# Altium project ThunderGuppy_3.0.PrjPcb (part 2 of 2)

## Sheet GPS.SchDoc
size A
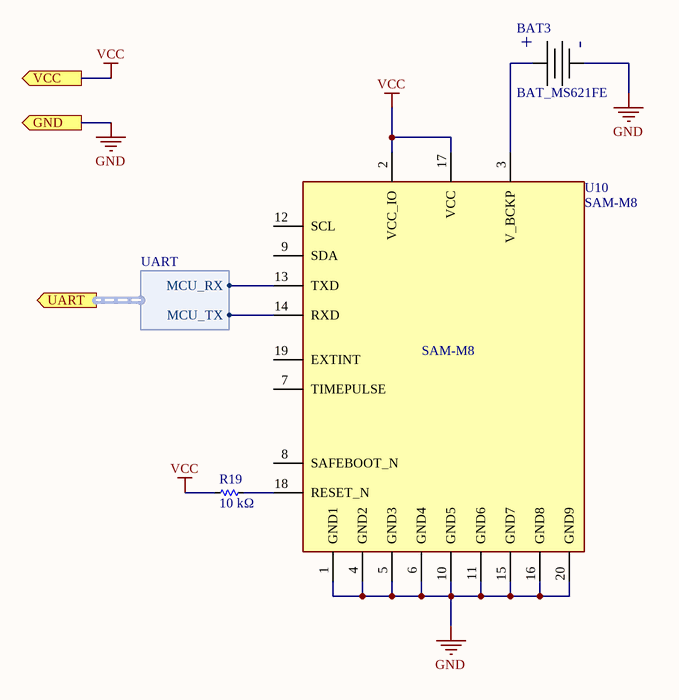
[diagram p6: GPS.SchDoc]

### Parts
BAT3  BAT_MS621FE  [BATT_COINCELL_RECHARGEABLE]
R19  Resistance: 10 kΩ  [R0603]  (hidden comment: 311-10.0KHRCT-ND)
U10  SAM-M8  [SAM-M8]

### Ports
GND (out), UART (out, harness UART), VCC (out)

### Harnesses
UART: MCU_RX, MCU_TX

### Nets
GND: BAT3.- U10.1(GND1) U10.4(GND2) U10.5(GND3) U10.6(GND4) U10.10(GND5) U10.11(GND6) U10.15(GND7) U10.16(GND8) U10.20(GND9) ; port GND
VCC: R19.1 U10.2(VCC_IO) U10.17(VCC) ; port VCC  [project net 3V3]
NetBAT3_+: BAT3.+ U10.3(V_BCKP)
NetR19_2: R19.2 U10.18(RESET_N)
NetU10_13: U10.13(TXD) ; port UART.MCU_RX
NetU10_14: U10.14(RXD) ; port UART.MCU_TX

Not connected (* = marked no-connect by the designer): U10 7(TIMEPULSE) 8(SAFEBOOT_N) 9(SDA) 12(SCL) 19(EXTINT)

### Library data of the parts
BAT3 = CMP-060-0000-1: MS621FE RECHARGEABLE COIN CELL BACKUP; Manufacturer: Seiko Instruments; Manufacturer Part Number: MS621FE-FL11E; Battery Chemistry: Lithium; Battery Cell Size: Coin, 6.8mm; Capacity: 5.5mAh; Discharge Rate: 15µA; Shipping Info: Due to restrictions, only ground shipment is allowed.; RoHS: RoHS Compliant; Stock 1: 41059; Pricing 1: 1=2.04, 10=1.838, 50=1.6338, 100=1.4296, 250=1.30704, 500=1.22534, 1000=1.09051, 2500=1.0112, 5000=0.99138 (USD); Part Status: Active; Size / Dimension: 0.27" Dia x 0.08" H (6.8mm x 2.1mm); Termination Style: SMD (SMT) Tab; Standard Charge Current: 15µA; Standard Charge Time: -; Weight: 0.23g; ComponentLink1URL: http://www.sii.co.jp/en/me/files/2017/04/MicroBatteryCatalogue-E_2017_web.pdf; ComponentLink1Description: http://www.sii.co.jp/en/me/files/2017/04/MicroBatteryCatalogue-E_2017_web.pdf; Design Item ID: BAT_MS621FE; Source: miscellaneous.SchLib
R19 = CMP-126-0273-1: RES SMD 10K OHM 1% 1/10W 0603; Manufacturer Part Number: RC0603FR-0710KL; Manufacturer: Yageo; Resistance (Sortable): 10000; Power (Watts): 0.1W, 1/10W; Temperature Coefficient: ±100ppm/°C; Datasheets: http://www.yageo.com/documents/recent/PYu-RC_Group_51_RoHS_L_9.pdf; Image: //media.digikey.com/Renders/Yageo%20Renders/0603-(1608-Metric).jpg; Tolerance: ±1%; Operating Temperature: -55°C ~ 155°C
U10 = SAM-M8: ublox SAM GNSS antenna module; Manufacturer: u-blox; Part Description: u-blox SAM GNSS antenna module; Value: SAM-M8

## Sheet Ematches.SchDoc
size A
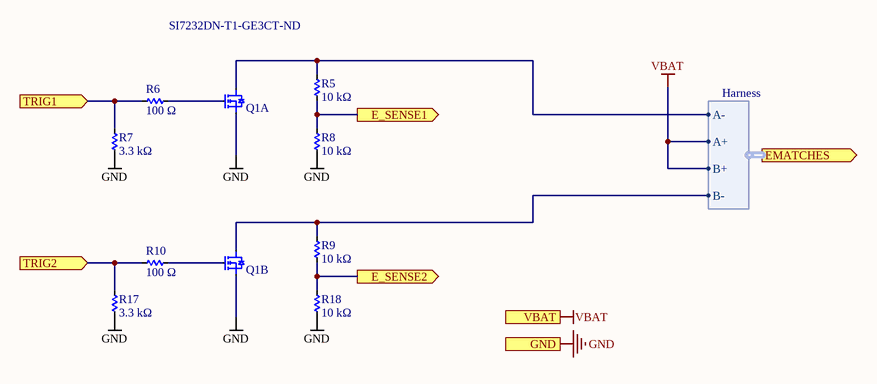
[diagram p7: Ematches.SchDoc]

### Parts
Q1  Supplier Part Number 1: SI7232DN-T1-GE3CT-ND  [POWERPAK_1212-8_DUAL]  (hidden comment: NFET_SI7232DN)  (parts A,B of 2)
R5  Resistance: 10 kΩ  [R0603]  (hidden comment: __template_resistor)
R6  Resistance: 100 Ω  [R0603]  (hidden comment: __template_resistor)
R7  Resistance: 3.3 kΩ  [R0603]  (hidden comment: __template_resistor)
R8  Resistance: 10 kΩ  [R0603]  (hidden comment: __template_resistor)
R9  Resistance: 10 kΩ  [R0603]  (hidden comment: __template_resistor)
R10  Resistance: 100 Ω  [R0603]  (hidden comment: __template_resistor)
R17  Resistance: 3.3 kΩ  [R0603]  (hidden comment: __template_resistor)
R18  Resistance: 10 kΩ  [R0603]  (hidden comment: __template_resistor)

### Ports
E_SENSE1 (out), E_SENSE2 (out), EMATCHES (out, harness Harness), GND (in), TRIG1 (in), TRIG2 (in), VBAT (in)

### Harnesses
Harness: A-, A+, B+, B-

### Nets
GND: Q1.1 Q1.3 R7.1 R8.2 R17.1 R18.2 ; port GND
VBAT: port VBAT, port EMATCHES.A+, port EMATCHES.B+
NetQ1_2: Q1.2 R6.2
NetQ1_4: Q1.4 R10.2
NetQ1_5: Q1.5 R9.1 ; port EMATCHES.B-
NetQ1_7: Q1.7 R5.1 ; port EMATCHES.A-
NetR5_2: R5.2 R8.1 ; port E_SENSE1
NetR6_1: R6.1 R7.2 ; port TRIG1
NetR9_2: R9.2 R18.1 ; port E_SENSE2
NetR10_1: R10.1 R17.2 ; port TRIG2

### Library data of the parts
Q1 = NFET_SI7232DN: MOSFET 2N-CH 20V 25A PPAK 1212-8; Manufacturer: Vishay Siliconix; Manufacturer Part Number: SI7232DN-T1-GE3; FET Type: 2 N-Channel (Dual); FET Feature: Logic Level Gate; Rds On (Max) @ Id, Vgs: 16.4 mOhm @ 10A, 4.5V; Vgs(th) (Max) @ Id: 1V @ 250µA; Gate Charge (Qg) @ Vgs: 32nC @ 8V; Input Capacitance (Ciss) @ Vds: 1220pF @ 10V; Power - Max: 23W; Supplier 1: Digi-Key; RoHS: RoHS Compliant; Category: Discrete Semiconductor Products; Stock 1: 12645; Pricing 1: 1=0.89, 10=0.782, 25=0.7344, 100=0.5994, 250=0.55672, 500=0.4738, 1000=0.37904 (USD); Packaging: Cut Tape (CT); Drain to Source Voltage (Vdss): 20V; Current - Continuous Drain (Id) @ 25°C: 25A; Operating Temperature: -55°C ~ 150°C (TJ); Mounting Type: Surface Mount; Package / Case: PowerPAK® 1212-8 Dual; Supplier Device Package: PowerPAK® 1212-8 Dual; ComponentLink1URL: http://www.vishay.com/docs/68986/si7232dn.pdf; ComponentLink1Description: http://www.vishay.com/docs/68986/si7232dn.pdf
R5 R8 R9 R18 = 311-10.0KHRCT-ND: RES SMD 10K OHM 1% 1/10W 0603; Manufacturer Part Number: RC0603FR-0710KL; Manufacturer: Yageo; Power (Watts): 0.1W, 1/10W; Resistance (Sortable): 10000; Temperature Coefficient: ±100ppm/°C; Tolerance: ±1%; Supplier Part Number 1: 311-10.0KHRCT-ND; Supplier 1: Digikey; Datasheets: http://www.yageo.com/documents/recent/PYu-RC_Group_51_RoHS_L_9.pdf; Image: //media.digikey.com/Renders/Yageo%20Renders/0603-(1608-Metric).jpg; Operating Temperature: -55°C ~ 155°C
R6 R10 = 311-100HRCT-ND: RES SMD 100 OHM 1% 1/10W 0603; Manufacturer Part Number: RC0603FR-07100RL; Manufacturer: Yageo; Power (Watts): 0.1W, 1/10W; Resistance (Sortable): 100; Temperature Coefficient: ±100ppm/°C; Tolerance: ±1%; Supplier Part Number 1: 311-100HRCT-ND; Supplier 1: Digikey; Datasheets: http://www.yageo.com/documents/recent/PYu-RC_Group_51_RoHS_L_9.pdf; Image: //media.digikey.com/Renders/Yageo%20Renders/0603-(1608-Metric).jpg; Operating Temperature: -55°C ~ 155°C
R7 R17 = 311-3.30KHRCT-ND: RES SMD 3.3K OHM 1% 1/10W 0603; Manufacturer Part Number: RC0603FR-073K3L; Manufacturer: Yageo; Power (Watts): 0.1W, 1/10W; Resistance (Sortable): 3300; Temperature Coefficient: ±100ppm/°C; Tolerance: ±1%; Supplier Part Number 1: 311-3.30KHRCT-ND; Supplier 1: Digikey; Datasheets: http://www.yageo.com/documents/recent/PYu-RC_Group_51_RoHS_L_9.pdf; Image: //media.digikey.com/Renders/Yageo%20Renders/0603-(1608-Metric).jpg; Operating Temperature: -55°C ~ 155°C

## Sheet RS485.SchDoc
size A
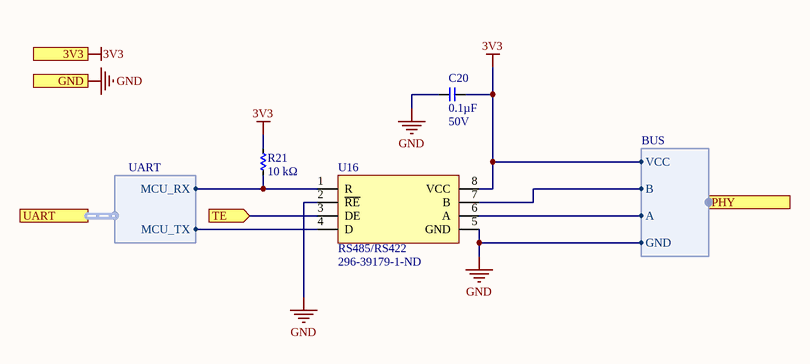
[diagram p8: RS485.SchDoc]

### Parts
C20  Capacitance (shorthand): 0.1µF  Rated Voltage: 50V  [C0603]  (hidden comment: __template_cap)
R21  Resistance: 10 kΩ  [R0603]  (hidden comment: __template_resistor)
U16  RS485/RS422  Supplier Part Number 1: 296-39179-1-ND  [8SOIC150]

### Ports
3V3 (in), GND (in), PHY (out, harness BUS), TE (in), UART (harness UART)

### Harnesses
UART: MCU_RX, MCU_TX
BUS: A, B, GND, VCC

### Nets
3V3: C20.2 R21.1 U16.8(VCC) ; port 3V3, port PHY.VCC
GND: C20.1 U16.2(~{RE}) U16.5(GND) ; port GND, port PHY.GND
RS485_TE: U16.3(DE) ; port TE
SELF_BUS_H: U16.6(A) ; port PHY.A
SELF_BUS_L: U16.7(B) ; port PHY.B
NetCANA1_1: R21.2 U16.1(R) ; port UART.MCU_RX
NetCANA1_4: U16.4(D) ; port UART.MCU_TX

### Library data of the parts
C20 = 490-1519-1-ND: CAP CER 0603 0.1µF X7R 50V 10%; Manufacturer: Murata Electronics North America; Capacitance - pF (Machine readable): #NAME?; type: capacitor; Dielectric: X7R; Supplier 1: Digikey; Supplier Part Number 1: 490-1519-1-ND
R21 = 311-10.0KHRCT-ND: as R5 on sheet Ematches; Tolerance: ±1%; Supplier Part Number 1: 311-10.0KHRCT-ND; Supplier 1: Digikey; Datasheets: http://www.yageo.com/documents/recent/PYu-RC_Group_51_RoHS_L_9.pdf; Image: //media.digikey.com/Renders/Yageo%20Renders/0603-(1608-Metric).jpg; Operating Temperature: -55°C ~ 155°C
U16 = SN65HVD7x: Manufacturer: Texas Instruments; Manufacturer Part Number: SN65HVD72DGKR; Min Supply Voltage: 3V; Max Supply Voltage: 3.6V; Number of Receivers: 1; Output Current: 8mA; Data Rate: 0.25Mbps; Logic Function: Transceiver; Simplex/Duplex: Half Duplex; Supply Voltage: 3.3V; Nominal Supply Current: 950uA; Output Voltage: 2V; Propagation Delay: 0.7us; Interface: RS-485; Case/Package: VSSOP; Number of Pins: 8; Min Operating Temperature: -40°C; Max Operating Temperature: 125°C; Packaging: Tape and Reel; Package Quantity: 2500; Number of Drivers: 1; Number of Transmitters: 1; Number of Transceivers: 1; Radiation Hardening: No; Lead Free: Lead Free; REACH SVHC: No SVHC; ComponentLink1URL: https://datasheet.ciiva.com/28650/1787953-28650706.pdf; ComponentLink1Description: https://datasheet.ciiva.com/28650/1787953-28650706.pdf; ComponentLink2URL: https://datasheet.ciiva.com/24096/sn65hvd72-446416-24096821.pdf; ComponentLink2Description: https://datasheet.ciiva.com/24096/sn65hvd72-446416-24096821.pdf; ComponentLink3URL: https://datasheet.ciiva.com/6636/sn65hvd72-6636345.pdf; ComponentLink3Description: https://datasheet.ciiva.com/6636/sn65hvd72-6636345.pdf; ComponentLink4URL: https://datasheet.ciiva.com/26946/getdatasheetpartid-716725-26946073.pdf; ComponentLink4Description: https://datasheet.ciiva.com/26946/getdatasheetpartid-716725-26946073.pdf; ComponentLink5URL: https://datasheet.ciiva.com/6636/sn65hvd72-6636346.pdf; ComponentLink5Description: https://datasheet.ciiva.com/6636/sn65hvd72-6636346.pdf; ComponentLink6URL: https://datasheet.ciiva.com/6636/sn65hvd72-6636347.pdf; ComponentLink6Description: https://datasheet.ciiva.com/6636/sn65hvd72-6636347.pdf; ComponentLink7URL: https://datasheet.ciiva.com/14195/sn65hvd75-14195211.pdf; ComponentLink7Description: https://datasheet.ciiva.com/14195/sn65hvd75-14195211.pdf; ComponentLink8URL: https://datasheet.ciiva.com/41461/001187608-da-01-en-ic-txrx-rs485-sn65hvd72dgkr-vssop-8-tid-41461063.pdf; ComponentLink8Description: https://datasheet.ciiva.com/41461/001187608-da-01-en-ic-txrx-rs485-sn65hvd72dgkr-vssop-8-tid-41461063.pdf; Supplier 1: Digi-Key

## Sheet CAN.SchDoc
size A
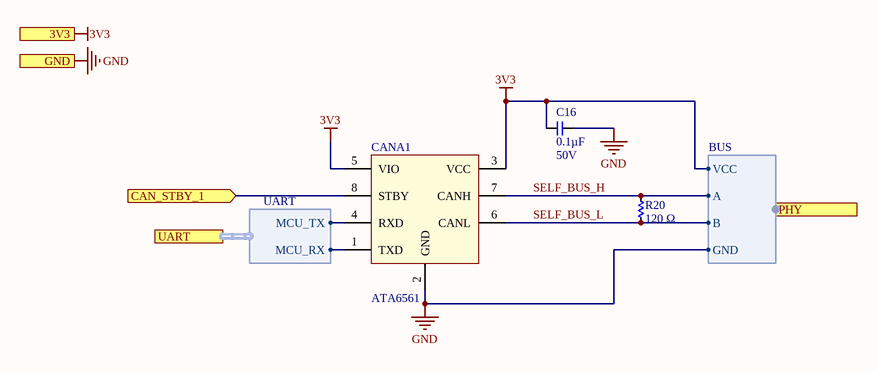
[diagram p9: CAN.SchDoc]

### Parts
C16  Capacitance (shorthand): 0.1µF  Rated Voltage: 50V  [C0603]  (hidden comment: 490-1519-1-ND)
CANA1  ATA6561  [8SOIC150]
R20  Resistance: 120 Ω  [R0603]  (hidden comment: 311-120HRCT-ND)

### Ports
3V3 (in), CAN_STBY_1 (in), GND (in), PHY (out, harness BUS), UART (harness UART)

### Harnesses
UART: MCU_RX, MCU_TX
BUS: A, B, GND, VCC

### Nets
3V3: C16.2 CANA1.3(VCC) CANA1.5(VIO) ; port 3V3, port PHY.VCC
GND: C16.1 CANA1.2(GND) ; port GND, port PHY.GND
CAN_STBY_1: CANA1.8(STBY) ; port CAN_STBY_1
SELF_BUS_H: CANA1.7(CANH) R20.2 ; port PHY.A
SELF_BUS_L: CANA1.6(CANL) R20.1 ; port PHY.B
NetCANA1_1: CANA1.1(TXD) ; port UART.MCU_RX
NetCANA1_4: CANA1.4(RXD) ; port UART.MCU_TX

### Library data of the parts
C16 = CMP-119-0065-1: CAP CER 0603 0.1µF X7R 50V 10%; Manufacturer: Murata Electronics North America; Capacitance - pF (Machine readable): #NAME?; Dielectric: X7R
CANA1 = CMP-041-0000-1: Atmel CAN Bus Transciever; Design Item ID: ATA6561; Source: ic_data_converters.SchLib
R20 = CMP-126-0077-1: RES SMD 120 OHM 1% 1/10W 0603; Manufacturer Part Number: RC0603FR-07120RL; Manufacturer: Yageo; Resistance (Sortable): 120; Power (Watts): 0.1W, 1/10W; Temperature Coefficient: ±100ppm/°C; Datasheets: http://www.yageo.com/documents/recent/PYu-RC_Group_51_RoHS_L_9.pdf; Image: //media.digikey.com/Renders/Yageo%20Renders/0603-(1608-Metric).jpg; Tolerance: ±1%; Operating Temperature: -55°C ~ 155°C

## Sheet Radio.SchDoc
size A
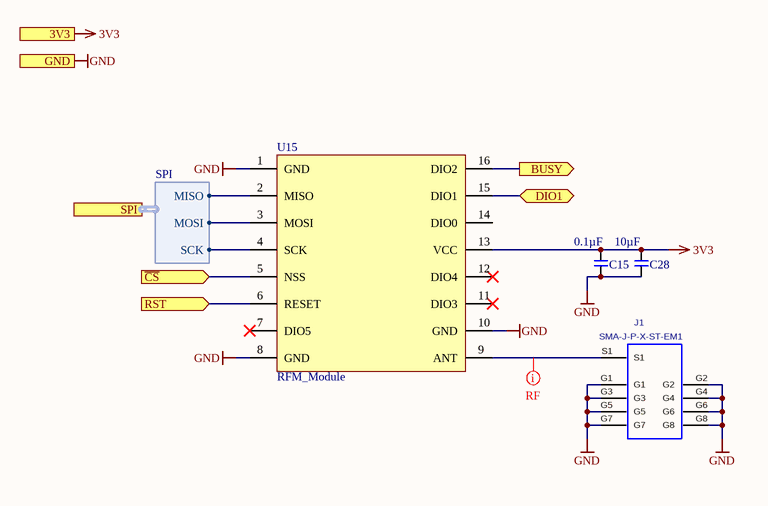
[diagram p10: Radio.SchDoc]

### Parts
C15  Capacitance (shorthand): 0.1µF  [C0603]  (hidden comment: 490-1519-1-ND)
C28  Capacitance (shorthand): 10µF  [C0603]  (hidden comment: 490-13248-1-ND)
J1  SMA-J-P-X-ST-EM1  [SMA-J-P-X-ST-EM1]
U15  RFM_Module  [RFM-22]

### Ports
3V3 (in), BUSY (out), DIO1 (bidir), GND (in), RST (in), SPI (harness SPI), ~{CS} (in)

### Harnesses
SPI: MISO, MOSI, SCK

### Nets
3V3: C15.1 C28.1 U15.13(VCC) ; port 3V3
GND: C15.2 C28.2 J1.G1 J1.G2 J1.G3 J1.G4 J1.G5 J1.G6 J1.G7 J1.G8 U15.1(GND) U15.8(GND) U15.10(GND) ; port GND
RF_BUSY: U15.16(DIO2) ; port BUSY
RF_CS: U15.5(NSS) ; port ~{CS}
RF_DIO1: U15.15(DIO1) ; port DIO1
NetJ1_S1: J1.S1 U15.9(ANT)
NetU12_35: U15.4(SCK) ; port SPI.SCK
NetU12_36: U15.3(MOSI) ; port SPI.MOSI
NetU12_37: U15.2(MISO) ; port SPI.MISO
NetU15_6: U15.6(RESET) ; port RST

Not connected (* = marked no-connect by the designer): U15 7(DIO5)* 11(DIO3)* 12(DIO4)* 14(DIO0)

### Layout directives
rule Clearance Constraint [Generic clearance = 30mil, and 10 value(s) for objects]: NetJ1_S1

### Library data of the parts
C15 = CMP-119-0065-1: as C16 on sheet CAN; Dielectric: X7R; Rated Voltage: 50V
C28 = CMP-119-0071-1: CAP CER 10UF 35V X5R 0603 20%; Manufacturer: Murata Electronics North America; Capacitance - pF (Machine readable): #NAME?; Rated Voltage: 35V; Dielectric: X5R
J1 = CMP-135-0000-2: SMA STRAIGHT, EDGE MOUNT JACK- 50 OHM; MANUFACTURER: SAMTEC; CREATED: APRIL 8 2014 - WENDY XIN; PCB DECAL: SMA-J-P-X-ST-EM1; Design Item ID: SMA-J-P-X-ST-EM1; Source: SMA-J-P-X-ST-EM1.SCHLIB
U15 = CMP-064-0007-1: Design Item ID: RFM_Module; Source: modules.SchLib

## Nets that join several sheets
3V3: Guppy (U14.8), Sensors (15 pins), Battery_Management (8 pins), Blink_Blink_Beep_Boop (D7.2 U4.1), SAMD51 (13 pins), SD (9 pins), GPS (R19.1 U10.2 U10.17), RS485 (C20.2 R21.1 U16.8), CAN (C16.2 CANA1.3 CANA1.5), Radio (C15.1 C28.1 U15.13)
GND: Guppy (BAT2.- U14.7 U14.S), Sensors (38 pins), Battery_Management (17 pins), Blink_Blink_Beep_Boop (5 pins), SAMD51 (23 pins), SD (C40.1 C41.2 U11.6), GPS (10 pins), Ematches (6 pins), RS485 (C20.1 U16.2 U16.5), CAN (C16.1 CANA1.2), Radio (13 pins)
VBACKUP: Guppy (BAT2.+), SAMD51 (U12.64)
VBAT: Guppy (D1.2 U14.2 U14.4), Battery_Management (7 pins)
VBUS: Guppy (D1.1), SAMD51 (C44.1 J2.1 U13.5)
ACCEL_CS_1: Sensors (U9.14), SAMD51 (U12.12)
ACCEL_CS_2: Sensors (U8.14), SAMD51 (U12.6)
ACCEL_INT_1: Sensors (U9.16), SAMD51 (U12.50)
ACCEL_INT_2: Sensors (U8.16), SAMD51 (U12.39)
ADXL_CS_1: Sensors (U6.7), SAMD51 (U12.9)
ADXL_CS_2: Sensors (U5.7), SAMD51 (U12.3)
ADXL_INT_1: Sensors (U6.8), SAMD51 (U12.49)
ADXL_INT_2: Sensors (U5.8), SAMD51 (U12.31)
BAT_SNS_A: Battery_Management (D2.2 R11.1 R12.2), SAMD51 (U12.63)
BMP_CS_1: Sensors (U3.6), SAMD51 (U12.10)
BMP_CS_2: Sensors (U7.6), SAMD51 (U12.4)
BUZZER: Blink_Blink_Beep_Boop (Q3.1), SAMD51 (U12.32)
CAN_STBY_1: SAMD51 (U12.41), CAN (CANA1.8)
GYRO_CS_1: Sensors (U9.5), SAMD51 (U12.11)
GYRO_CS_2: Sensors (U8.5), SAMD51 (U12.5)
GYRO_INT_1: Sensors (U9.12), SAMD51 (U12.51)
GYRO_INT_2: Sensors (U8.12), SAMD51 (U12.40)
LED_1: Blink_Blink_Beep_Boop (R13.1), SAMD51 (P1.4 R58.1 U12.57)
LED_2: Blink_Blink_Beep_Boop (R14.1), SAMD51 (P1.2 U12.58)
LED_3: Blink_Blink_Beep_Boop (R15.1), SAMD51 (U12.59)
LED_4: Blink_Blink_Beep_Boop (R16.1), SAMD51 (U12.60)
MISO: Sensors (8 pins), SAMD51 (U12.13)
MOSI: Sensors (6 pins), SAMD51 (U12.16)
NetCANA1_1: SAMD51 (U12.26), RS485 (R21.2 U16.1), CAN (CANA1.1)
NetCANA1_4: SAMD51 (U12.25), RS485 (U16.4), CAN (CANA1.4)
NetQ1_5: Guppy (U14.3), Ematches (Q1.5 R9.1)
NetQ1_7: Guppy (U14.1), Ematches (Q1.7 R5.1)
NetR5_2: SAMD51 (U12.62), Ematches (R5.2 R8.1)
NetR6_1: SAMD51 (U12.42), Ematches (R6.1 R7.2)
NetR9_2: SAMD51 (U12.61), Ematches (R9.2 R18.1)
NetR10_1: SAMD51 (U12.44), Ematches (R10.1 R17.2)
NetU10_13: SAMD51 (U12.30), GPS (U10.13)
NetU10_14: SAMD51 (U12.29), GPS (U10.14)
NetU12_35: SAMD51 (U12.35), Radio (U15.4)
NetU12_36: SAMD51 (U12.36), Radio (U15.3)
NetU12_37: SAMD51 (U12.37), Radio (U15.2)
RF_BUSY: SAMD51 (U12.43), Radio (U15.16)
RF_CS: SAMD51 (U12.38), Radio (U15.5)
RF_DIO1: SAMD51 (U12.28), Radio (U15.15)
RS485_TE: SAMD51 (U12.27), RS485 (U16.3)
SCK: Sensors (6 pins), SAMD51 (U12.14)
SD_CD: SAMD51 (U12.15), SD (R52.2 U11.CD)
SD_CLK: SAMD51 (U12.24), SD (U11.5)
SD_CMD: SAMD51 (U12.17), SD (R48.2 U11.3)
SD_DAT0: SAMD51 (U12.18), SD (R49.2 U11.7)
SD_DAT1: SAMD51 (U12.19), SD (R51.2 U11.8)
SD_DAT2: SAMD51 (U12.20), SD (R50.2 U11.1)
SD_DAT3: SAMD51 (U12.23), SD (R47.2 U11.2)
SELF_BUS_H: Guppy (U14.6), RS485 (U16.6), CAN (CANA1.7 R20.2)
SELF_BUS_L: Guppy (U14.5), RS485 (U16.7), CAN (CANA1.6 R20.1)